# EAGLE design P6F (EAGLE 7.4.0)
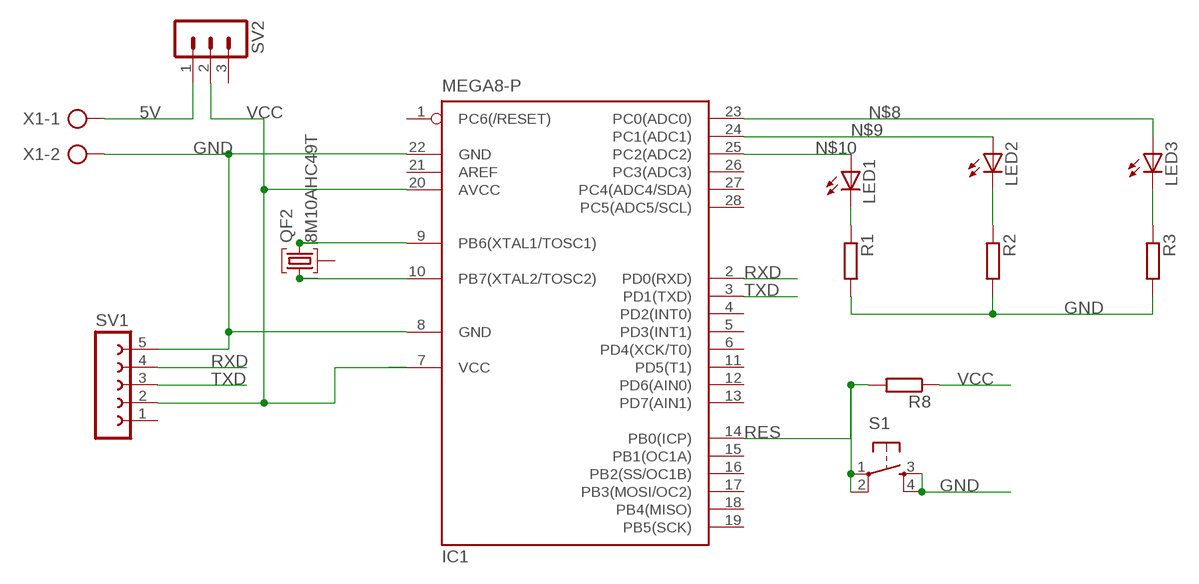
[diagram p0: schematic, sheet 1]

## Parts
IC1  MEGA8-P  [DIL28-3]
LED1  LED5MM  [LED5MM]
LED2  LED5MM  [LED5MM]
LED3  LED5MM  [LED5MM]
QF2  8M10AHC49T  [HC49U]
R1  R-EU_0204/7  [0204/7]
R2  R-EU_0204/7  [0204/7]
R3  R-EU_0204/7  [0204/7]
R8  R-EU_0204/7  [0204/7]
S1  TAC_SWITCHPTH  [TACTILE-PTH]
SV1  FE05-1  [FE05-1]
SV2  MA03-1  [MA03-1]
X1  AK300/2  [AK300/2]

## Nets
5V: SV2.1 X1.1
GND: IC1.8(GND) IC1.22(GND) R1.2 R2.2 R3.2 S1.3 S1.4 SV1.5 X1.2
N$5: LED1.K(C) R1.1
N$6: LED2.K(C) R2.1
N$7: LED3.K(C) R3.1
N$8: IC1.23(PC0(ADC0)) LED3.A
N$9: IC1.24(PC1(ADC1)) LED2.A
N$10: IC1.25(PC2(ADC2)) LED1.A
N$17: IC1.9(PB6(XTAL1/TOSC1)) QF2.3
N$18: IC1.10(PB7(XTAL2/TOSC2)) QF2.1
RES: IC1.14(PB0(ICP)) R8.2 S1.1 S1.2
RXD: IC1.2(PD0(RXD)) SV1.4
TXD: IC1.3(PD1(TXD)) SV1.3
VCC: IC1.7(VCC) IC1.20(AVCC) R8.1 SV1.2 SV2.2
Unconnected: IC1.1(PC6(/RESET)) IC1.4(PD2(INT0)) IC1.5(PD3(INT1)) IC1.6(PD4(XCK/T0)) IC1.11(PD5(T1)) IC1.12(PD6(AIN0)) IC1.13(PD7(AIN1)) IC1.15(PB1(OC1A)) IC1.16(PB2(SS/OC1B)) IC1.17(PB3(MOSI/OC2)) IC1.18(PB4(MISO)) IC1.19(PB5(SCK)) IC1.21(AREF) IC1.26(PC3(ADC3)) IC1.27(PC4(ADC4/SDA)) IC1.28(PC5(ADC5/SCL)) QF2.2 SV1.1 SV2.3

## Library data of the parts
IC1 = atmel:MEGA8-P: MICROCONTROLLER 8 Kbytes FLASH, 1 kbytes SRAM, 512 bytes EEPROM, USART, 4-channel 10 bit ADC, 2-channel 8 bit ADC Pin compatible with Atmega48, ATMega88, ATMega168 Source: avr.lbr; OC_FARNELL: unknown; OC_NEWARK: unknown
LED1-LED3 = led:LED: LED OSRAM: - CHIPLED LG R971, LG N971, LY N971, LG Q971, LY Q971, LO R971, LY R971 LH N974, LH R974 LS Q976, LO Q976, LY Q976 LO Q996 - Hyper CHIPLED LW Q18S LB Q993, LB Q99A, LB R99A - SideLED LS A670, LO A670, LY A670, LG A670, LP A670 LB A673, LV A673, LT A673, LW A673 LH A674 LY A675 LS A676, LA A676, LO A676, LY A676, LW A676 LS A679, LY A679, LG A679 - Hyper Micro SIDELED® LS Y876, LA Y876, LO Y876, LY Y876 LT Y87S - SmartLED LW L88C, LW L88S LB L89C, LB L89S, LG L890 LS L89K, LO L89K, LY L89K LS L896, LA L896, LO L896, LY L896 - TOPLED LS T670, LO T670, LY T670, LG T670, LP T670 LSG T670, LSP T670, LSY T670, LOP T670, LYG T670 LG T671, LOG T671, LSG T671 LB T673, LV T673, LT T673, LW T673 LH T674 LS T676, LA T676, LO T676, LY T676, LB T676, LH T676, LSB T676, LW T676 LB T67C, LV T67C, LT T67C, LS T67K, LO T67K, LY T67K, LW E67C LS E67B, LA E67B, LO E67B, LY E67B, LB E67C, LV E67C, LT E67C LW T67C LS T679, LY T679, LG T679 LS T770, LO T770, LY T770, LG T770, LP T770 LB T773, LV T773, LT T773, LW T773 LH T774 LS E675, LA E675, LY E675, LS T675 LS T776, LA T776, LO T776, LY T776, LB T776 LHGB T686 LT T68C, LB T68C - Hyper Mini TOPLED® LB M676 - Mini TOPLED Santana® LG M470 LS M47K, LO M47K, LY M47K Source: http://www.osram.convergy.de LUXEON: - LUMILED® LXK2-PW12-R00, LXK2-PW12-S00, LXK2-PW14-U00, LXK2-PW14-V00 LXK2-PM12-R00, LXK2-PM12-S00, LXK2-PM14-U00 LXK2-PE12-Q00, LXK2-PE12-R00, LXK2-PE12-S00, LXK2-PE14-T00, LXK2-PE14-U00 LXK2-PB12-K00, LXK2-PB12-L00, LXK2-PB12-M00, LXK2-PB14-N00, LXK2-PB14-P00, LXK2-PB14-Q00 LXK2-PR12-L00, LXK2-PR12-M00, LXK2-PR14-Q00, LXK2-PR14-R00 LXK2-PD12-Q00, LXK2-PD12-R00, LXK2-PD12-S00 LXK2-PH12-R00, LXK2-PH12-S00 LXK2-PL12-P00, LXK2-PL12-Q00, LXK2-PL12-R00 Source: www.luxeon.com KINGBRIGHT: KA-3528ASYC Source: www.kingbright.com
QF2 = crystal:8M10AHC49T: Monolithic Crystal Filters Source: www.vanlong.com; OC_FARNELL: unknown; OC_NEWARK: unknown
R1-R3 R8 = rcl:R-EU_: RESISTOR, European symbol
S1 = SparkFun-Retired:TAC_SWITCH: Momentary Switch Button commonly used for reset or general input. Spark Fun Electronics SKU : COM-00097 SMT- SWCH-08247
SV1 = con-lsta:FE05-1: FEMALE HEADER; OC_FARNELL: unknown; OC_NEWARK: unknown
SV2 = con-lstb:MA03-1: PIN HEADER; OC_FARNELL: unknown; OC_NEWARK: unknown
X1 = con-ptr500:AK300/2: CONNECTOR; OC_FARNELL: unknown; OC_NEWARK: unknown

## Board
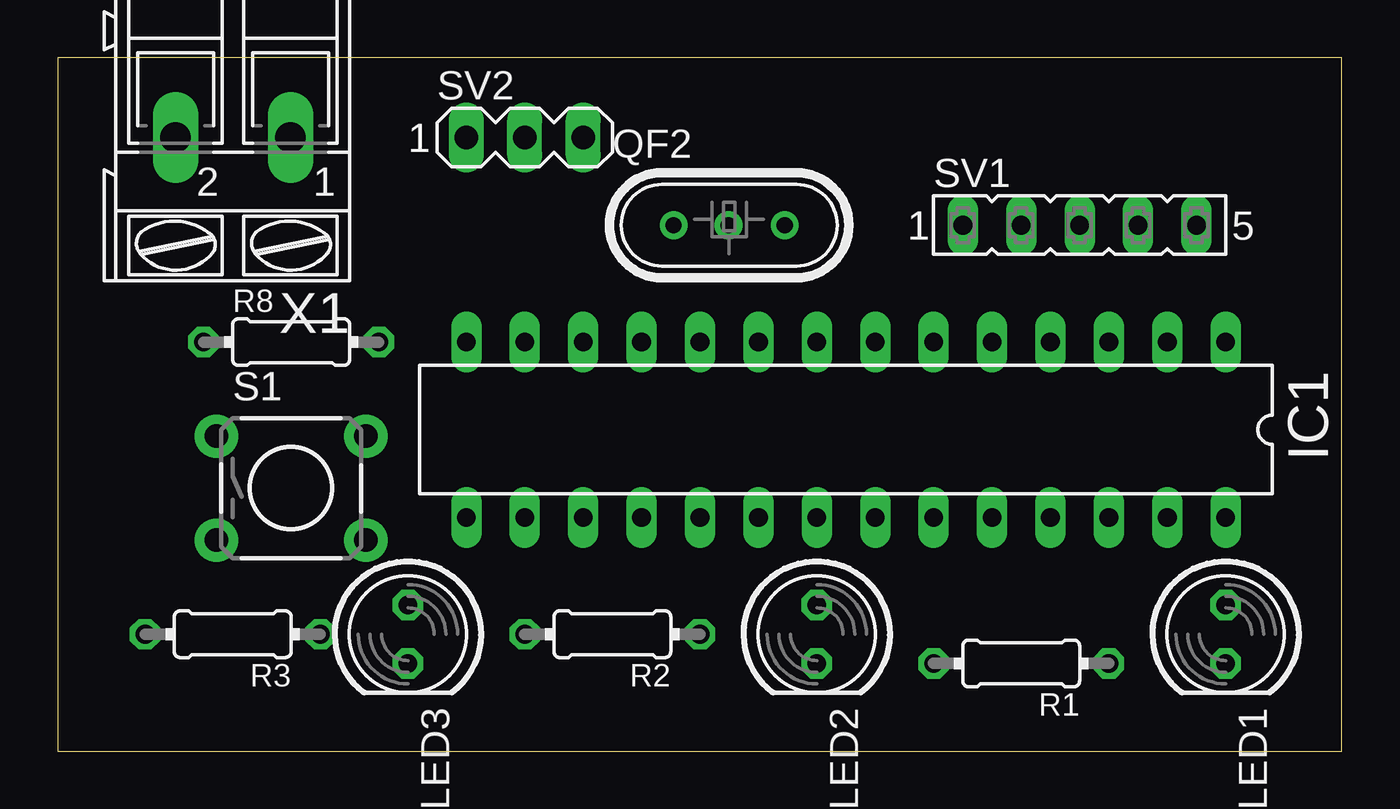
[diagram p1: board, top side]
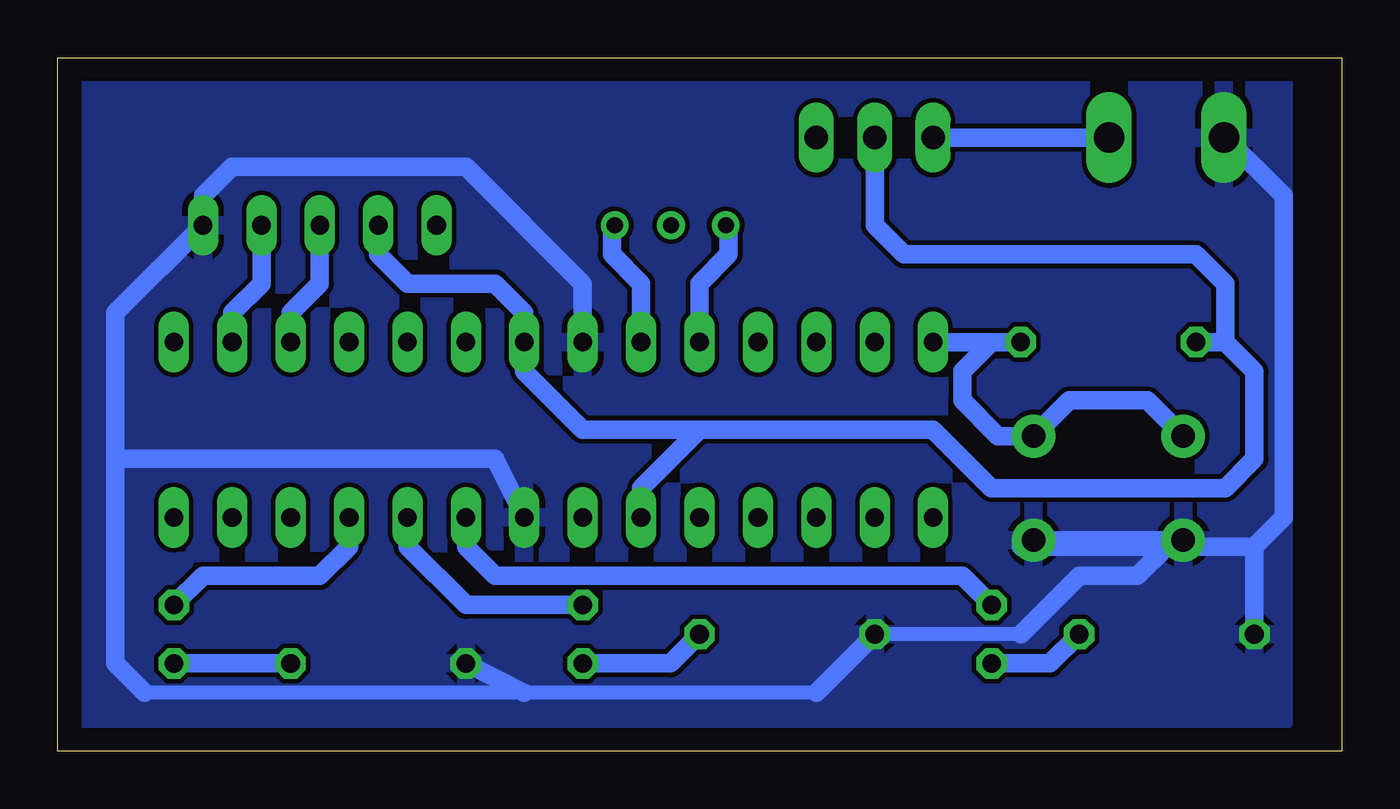
[diagram p2: board, bottom side, seen from below]

Size 55.86 x 30.15 mm. Coordinates in mm from the lower left corner, seen from the top.
Outline: 0,0 55.86,0 55.86,30.15 0,30.15 0,0
Copper layers (1*16): Top 0.035mm / dielectric 1.5mm / Bottom 0.035mm
Design rules "default *": minimum track width 10mil, minimum drill 24mil, track to track 8mil, track to pad 12mil, pad to pad 12mil, via to via 12mil, smd to smd 8mil, copper to edge 40mil, drill to drill 8mil, minimum pad ring 10mil, minimum via ring 8mil, stop-mask expansion 4mil, vias tented up to drill 0mil, thermal gap 10mil

### Footprints (pad centres in the part's own frame; a part is rotated, then mirrored left to right if it is on the bottom)
DIL28-3 = drill 0.813 long: 1 -16.51,-3.81; 2 -13.97,-3.81; 3 -11.43,-3.81; 4 -8.89,-3.81; 5 -6.35,-3.81; 6 -3.81,-3.81; 7 -1.27,-3.81; 8 1.27,-3.81; 9 3.81,-3.81; 10 6.35,-3.81; 11 8.89,-3.81; 12 11.43,-3.81; 13 13.97,-3.81; 14 16.51,-3.81; 15 16.51,3.81; 16 13.97,3.81; 17 11.43,3.81; 18 8.89,3.81; 19 6.35,3.81; 20 3.81,3.81; 21 1.27,3.81; 22 -1.27,3.81; 23 -3.81,3.81; 24 -6.35,3.81; 25 -8.89,3.81; 26 -11.43,3.81; 27 -13.97,3.81; 28 -16.51,3.81
LED5MM = drill 0.813 octagon: A -1.27,0; K 1.27,0
HC49U = drill 0.7 pad 1.2: 1 -2.413,0; 2 -0.027,0; 3 2.413,0
0204/7 = drill 0.813 octagon: 1 -3.81,0; 2 3.81,0
TACTILE-PTH = drill 1.016 pad 1.88: 1 -3.251,2.261; 2 3.251,2.261; 3 -3.251,-2.261; 4 3.251,-2.261
FE05-1 = drill 0.813 long: 1 -5.08,0; 2 -2.54,0; 3 0,0; 4 2.54,0; 5 5.08,0
MA03-1 = drill 1.016 long: 1 -2.54,0; 2 0,0; 3 2.54,0
AK300/2 = drill 1.321 long: 1 -2.515,0; 2 2.489,0

### Placement (x,y rotation side)
IC1  34.29,13.97 180 top
LED1  50.8,5.08 270 top
LED2  33.02,5.08 270 top
LED3  15.24,5.08 270 top
QF2  29.21,22.86 0 top
R1  41.91,3.81 180 top
R2  24.13,5.08 180 top
R3  7.62,5.08 180 top
R8  10.16,17.78 0 top
S1  10.16,11.43 0 top
SV1  44.45,22.86 0 top
SV2  20.32,26.67 0 top
X1  7.62,26.67 180 top

### Tracks (layer width: path | path; a pad name or v marks a point on that pad's centre or on a via)
5V
  Bottom 0.813: X1.1 SV2.1
GND
  Bottom 0.61: 13.97,5.08 R2.2 | 22.86,2.54 35.56,2.54 52.07,2.54
  Bottom 0.813: IC1.22 36.83,12.7 53.34,12.7 | S1.3 6.63,8.89 | 3.81,8.89 2.54,10.16 2.54,24.13 5.08,26.67 X1.2 | 3.81,8.89 R3.2 | 3.81,8.89 6.91,8.89 | 6.91,8.89 S1.3 | S1.3 S1.4 | S1.4 13.97,9.17 13.97,8.89 13.41,8.89 S1.4 | S1.4 13.13,8.89 7.62,8.89 | 7.62,8.89 6.91,8.89 | 7.62,8.89 8.89,7.62 11.43,7.62 13.97,5.08 | R2.2 22.86,2.54 | 52.07,2.54 53.34,3.81 53.34,12.7 | R1.2 35.56,2.54 | 53.34,12.7 53.34,19.05 SV1.5 49.53,24.13 48.26,25.4 38.1,25.4 33.02,20.32 IC1.8
  pour Bottom: 2.54,1.27 2.54,29.21 54.61,29.21 54.61,1.27
N$5
  Bottom 0.813: R1.1 LED1.K
N$6
  Bottom 0.813: R2.1 29.21,3.81 LED2.K
N$7
  Bottom 0.813: R3.1 12.7,3.81 LED3.K
N$8
  Bottom 0.813: IC1.23 38.1,8.89 36.83,7.62 16.51,7.62 LED3.A
N$9
  Bottom 0.813: LED2.A 38.1,6.35 40.64,8.89 IC1.24
N$10
  Bottom 0.813: IC1.25 43.18,8.89 44.45,7.62 49.53,7.62 LED1.A
N$17
  Bottom 0.813: QF2.3 31.75,22.73 31.75,21.59 30.48,20.32 IC1.9
N$18
  Bottom 0.813: QF2.1 26.67,22.73 26.67,21.59 27.94,20.32 IC1.10
RES
  Bottom 0.813: S1.1 8.46,15.24 11.86,15.24 S1.2 14.96,13.69 16.51,15.24 16.51,16.51 15.24,17.78 | 15.24,17.78 IC1.14 | R8.2 15.24,17.78
RXD
  Bottom 0.813: IC1.2 48.26,19.05 46.99,20.32 SV1.4
TXD
  Bottom 0.813: IC1.3 45.72,19.05 44.45,20.32 SV1.3
VCC
  Bottom 0.813: IC1.20 30.48,11.43 27.94,13.97 | 27.94,13.97 33.02,13.97 35.56,16.51 IC1.7 35.56,19.05 36.83,20.32 40.64,20.32 41.91,21.59 SV1.2 | 5.08,17.78 3.81,16.51 3.81,12.7 5.08,11.43 15.24,11.43 17.78,13.97 27.94,13.97 | R8.1 5.08,17.78 | 5.08,17.78 5.08,20.32 6.35,21.59 19.05,21.59 20.32,22.86 SV2.2